# Altium project Rocket logger.PrjPcb
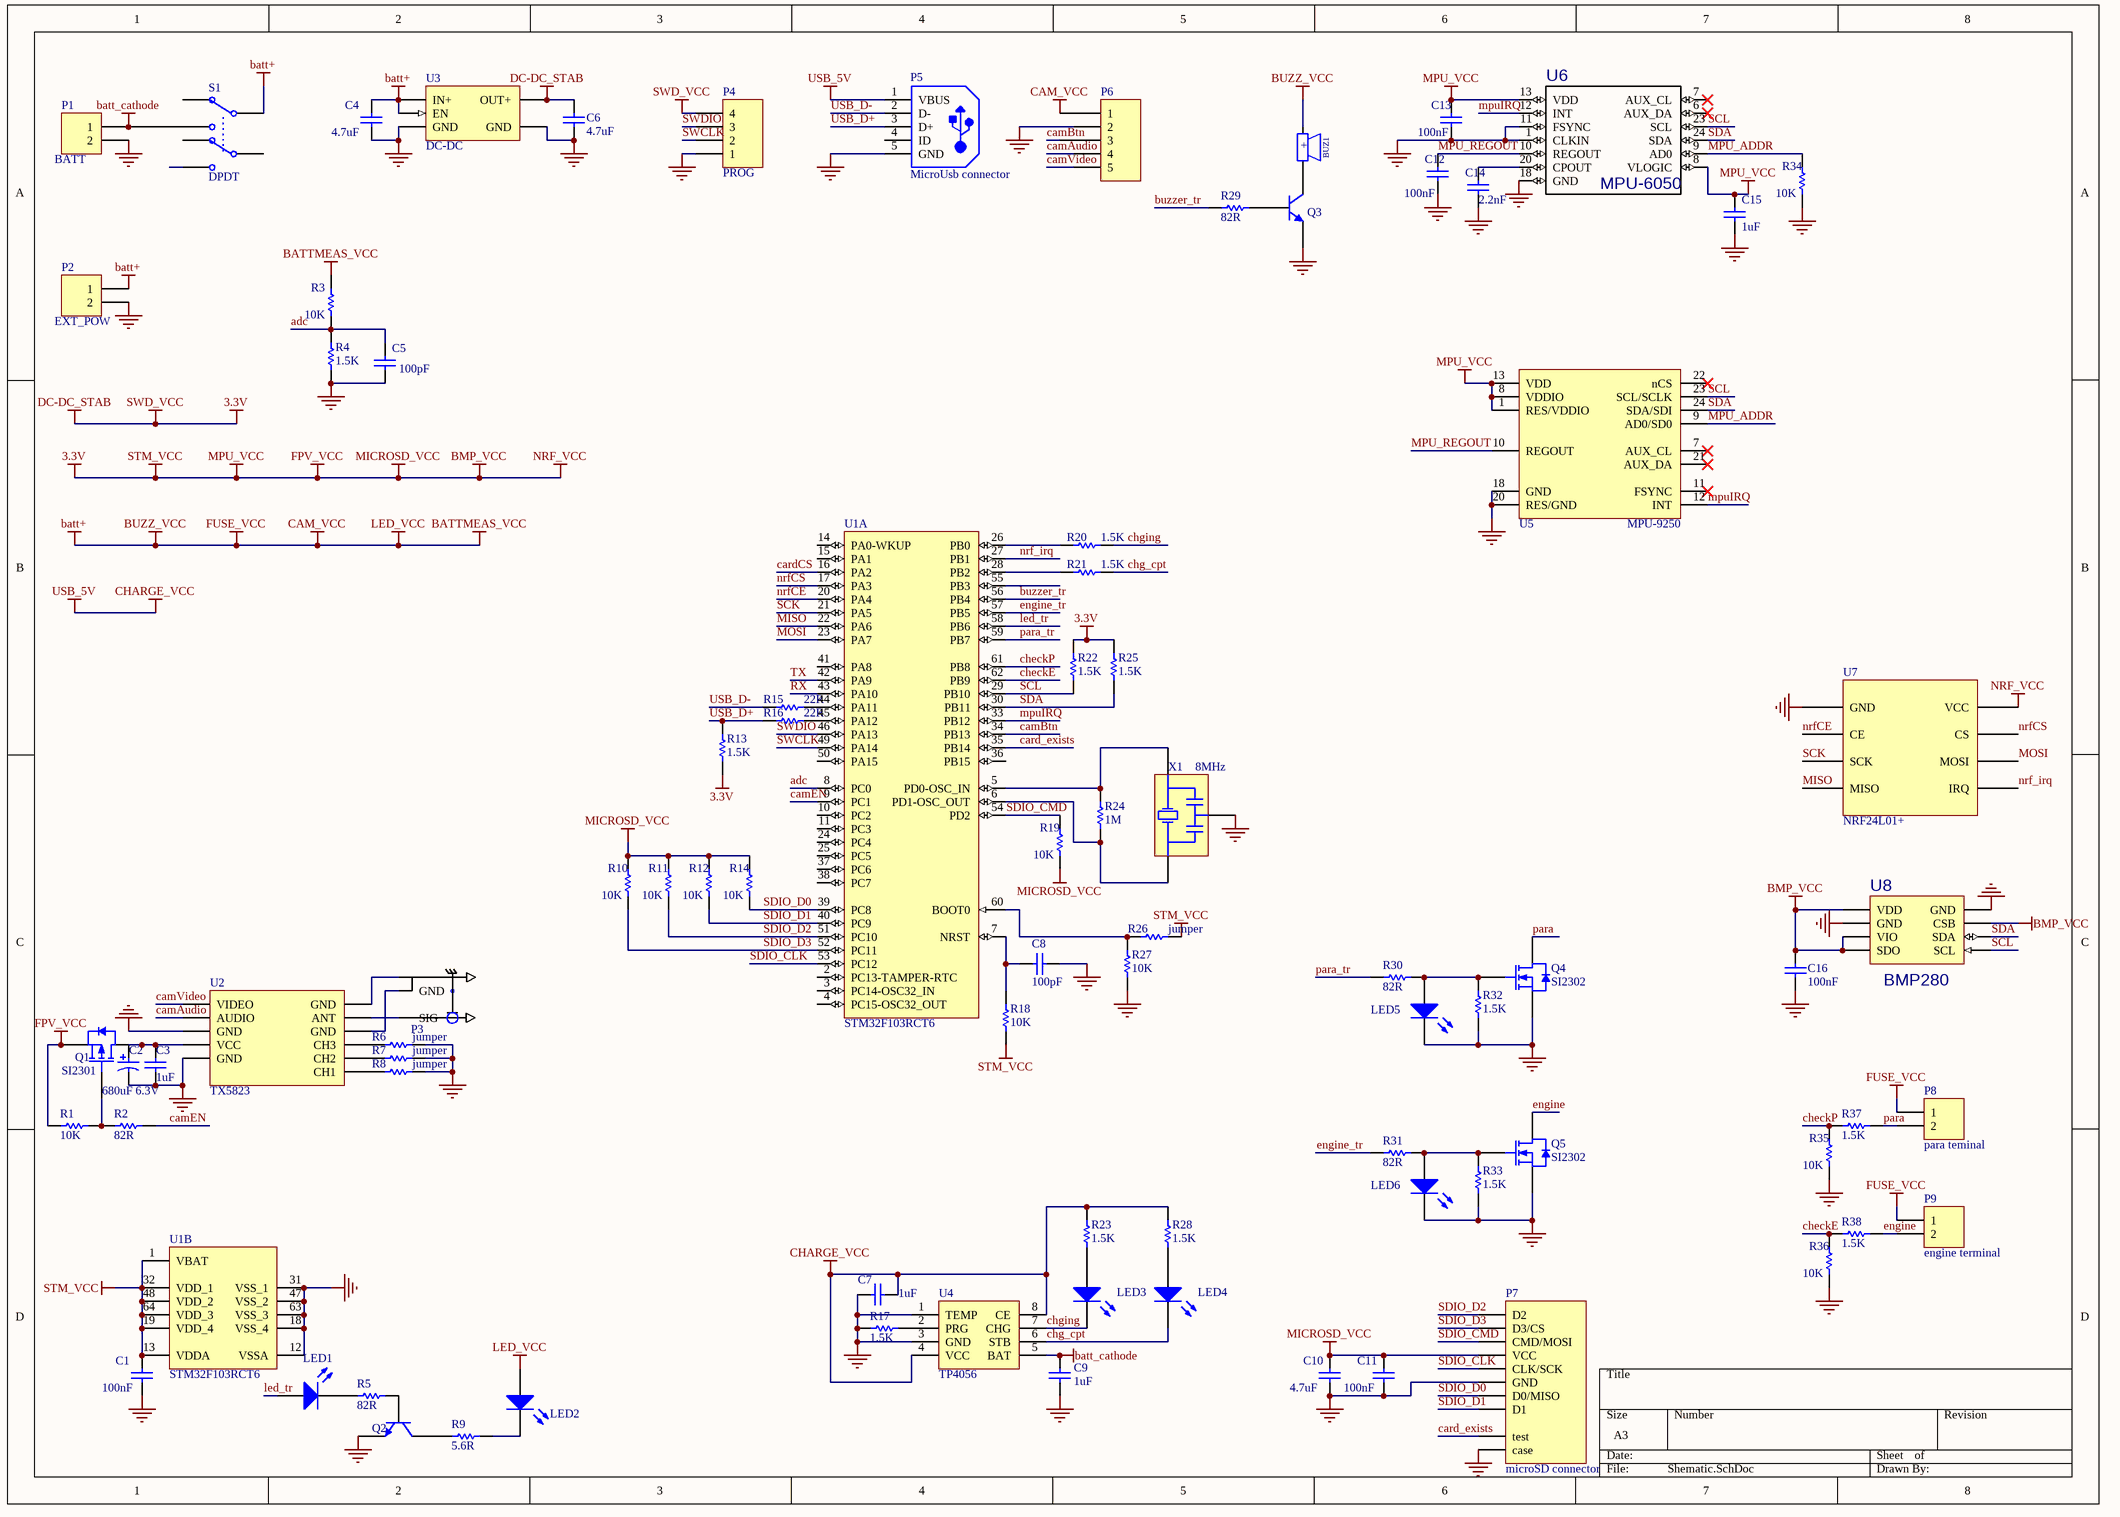
[diagram p0: Shematic.SchDoc]
1 sheet, 86 parts. Net scope: global (net labels, ports and power ports of the same name join across sheets).
Board files: PCB.PcbDoc, panel.PcbDoc

## Sheet Shematic.SchDoc
size A3

### Parts
(Parts that share a designator on the sheet are numbered #1, #2 ... from top to bottom, then left to right.)
BUZ1  Buzzer  [BUZ12X7,6MM]  (value not drawn)
C1  100nF  [CAPC0603(1608)100_L]
C2  680uF 6.3V  [CAPPR55-250-1120X630X1220]
C3  1uF  [CAPC0603(1608)100_L]
C4  4.7uF  [CAPC0603(1608)100_L]
C5  100pF  [CAPC0603(1608)100_L]
C6  4.7uF  [CAPC0603(1608)100_L]
C7  1uF  [CAPC0603(1608)100_L]
C8  100pF  [CAPC0603(1608)100_L]
C9  1uF  [CAPC0603(1608)100_L]
C10  4.7uF  [CAPC0603(1608)100_L]
C11  100nF  [CAPC0603(1608)100_L]
C12  100nF  [CAPC0603(1608)100_L]
C13  100nF  [CAPC0603(1608)100_L]
C14  2.2nF  [CAPC0603(1608)100_L]
C15  1uF  [CAPC0603(1608)100_L]
C16  100nF  [CAPC0603(1608)100_L]
LED1  0805 LED  [0805 LED]  (value not drawn)
LED2  3W LED  [3W LED red]  (value not drawn)
LED3  0805 LED  [0805 LED]  (value not drawn)
LED4  0805 LED  [0805 LED]  (value not drawn)
LED5  0805 LED  [0805 LED]  (value not drawn)
LED6  0805 LED  [0805 LED]  (value not drawn)
P1  BATT  [XH2.54-2]
P2  EXT_POW  [XH2.54-2]
P3  IPX  [IPX]  (value not drawn)
P4  PROG  [PLS-4]
P5  MicroUsb connector  [MicroUsb connector]
P6  XH2.54-5  [XH2.54-5]  (value not drawn)
P7  microSD connector  [Micro SD holder + card]
P8  para teminal  [screw-con-2]
P9  engine terminal  [screw-con-2]
Q1  SI2301  [SOT23-3 L]
Q2  MMBT2222A  [INF-SOT23_L]  (value not drawn)
Q3  MMBT2222A  [INF-SOT23_L]  (value not drawn)
Q4  SI2302  [SOT23-3 L]
Q5  SI2302  [SOT23-3 L]
R1  10K  [RES 0603 (1608) L]
R2  82R  [RES 0603 (1608) L]
R3  10K  [RES 0603 (1608) L]
R4  1.5K  [RES 0603 (1608) L]
R5  82R  [RES 0603 (1608) L]
R6  jumper  [RES 0603 (1608) L]
R7  jumper  [RES 0603 (1608) L]
R8  jumper  [RES 0603 (1608) L]
R9  5.6R  [RES 1206 (3216) N]
R10  10K  [RES 0603 (1608) L]
R11  10K  [RES 0603 (1608) L]
R12  10K  [RES 0603 (1608) L]
R13  1.5K  [RES 0603 (1608) L]
R14  10K  [RES 0603 (1608) L]
R15  22R  [RES 0603 (1608) L]
R16  22R  [RES 0603 (1608) L]
R17  1.5K  [RES 0603 (1608) L]
R18  10K  [RES 0603 (1608) L]
R19  10K  [RES 0603 (1608) L]
R20  1.5K  [RES 0603 (1608) L]
R21  1.5K  [RES 0603 (1608) L]
R22  1.5K  [RES 0603 (1608) L]
R23  1.5K  [RES 0603 (1608) L]
R24  1M  [RES 0603 (1608) L]
R25  1.5K  [RES 0603 (1608) L]
R26  jumper  [RES 0603 (1608) L]
R27  10K  [RES 0603 (1608) L]
R28  1.5K  [RES 0603 (1608) L]
R29  82R  [RES 0603 (1608) L]
R30  82R  [RES 0603 (1608) L]
R31  82R  [RES 0603 (1608) L]
R32  1.5K  [RES 0603 (1608) L]
R33  1.5K  [RES 0603 (1608) L]
R34  10K  [RES 0603 (1608) L]
R35  10K  [RES 0603 (1608) L]
R36  10K  [RES 0603 (1608) L]
R37  1.5K  [RES 0603 (1608) L]
R38  1.5K  [RES 0603 (1608) L]
S1  DPDT  [DPDT  5.8mm SMD]
U1#1  STM32F103RCT6  [STM-LQFP64_N]  (part A of 2)
U1#2  STM32F103RCT6  [STM-LQFP64_N]  (part B of 2)
U2  TX5823  [TX5823]
U3  DC-DC  [DC-DC step up down S9]
U4  TP4056  [SOP-8 N pad]
U5  MPU-9250  [QFN40P300X300X105_HS-25L]
U6  MPU-6050  [QFN-24-4MM2]
U7  NRF24L01+  [NRF24l01 ant]
U8  BMP280  [LGA-8 BMP280]
X1  8MHz  [MURA-CSTCE_G_A-3_V]

### Nets
3.3V: C1.2 C6.2 C10.2 C11.2 C13.1 C15.2 C16.2 P4.4 P7.4(VCC) Q1.3(S) R1.2 R10.1 R11.1 R12.1 R13.2 R14.1 R18.1 R19.2 R22.1 R25.1 R26.2 U1#2.1(VBAT) U1#2.13(VDDA) U1#2.19(VDD_4) U1#2.32(VDD_1) U1#2.48(VDD_2) U1#2.64(VDD_3) U3.2(OUT+) U5.1(RES/VDDIO) U5.8(VDDIO) U5.13(VDD) U6.8(VLOGIC) U6.13(VDD) U7.2(VCC) U8.2(CSB) U8.5(SDO) U8.6(VIO) U8.8(VDD)  [also labelled BMP_VCC, DC-DC_STAB, FPV_VCC, MICROSD_VCC, MPU_VCC, NRF_VCC, STM_VCC, SWD_VCC]
batt+: BUZ1.2 C4.2 LED2.A P2.1 P6.1 P8.1 P9.1 R3.1 S1.2 U3.4(IN+) U3.5(EN)  [also labelled BATTMEAS_VCC, BUZZ_VCC, CAM_VCC, FUSE_VCC, LED_VCC]
batt_cathode: C9.2 P1.1 S1.3 U4.5(BAT)
CHARGE_VCC: C7.1 P5.1(VBUS) R23.1 R28.1 U4.4(VCC) U4.8(CE)  [also labelled USB_5V]
GND: C1.1 C2.2 C3.2 C4.1 C5.1 C6.1 C7.2 C8.1 C9.1 C10.1 C11.1 C12.1 C13.2 C14.1 C15.1 C16.1 LED5.2(K) LED6.2(K) P1.2 P2.2 P4.1 P5.5(GND) P5.6(SHLD1) P5.7(SHLD2) P5.8(SHLD3) P5.9(SHLD4) P5.10(SHLD5) P5.11(SHLD6) P6.2 P7.0(case) P7.6(GND) Q2.2(E) Q3.2(E) Q4.2(S) Q5.2(S) R4.2 R6.2 R7.2 R8.2 R17.1 R27.1 R32.2 R33.2 R34.2 R35.2 R36.2 U1#2.12(VSSA) U1#2.18(VSS_4) U1#2.31(VSS_1) U1#2.47(VSS_2) U1#2.63(VSS_3) U2.3(GND) U2.5(GND) U3.1(GND) U3.3(GND) U4.1(TEMP) U4.3(GND) U4.PAD U5.18(GND) U5.20(RES/GND) U6.1(CLKIN) U6.11(FSYNC) U6.18(GND) U7.1(GND) U8.1(GND) U8.7(GND) X1.2(GND)
adc: C5.2 R3.2 R4.1 U1#1.8(PC0)
buzzer_tr: R29.2 U1#1.56(PB4)
camAudio: P6.4 U2.2(AUDIO)
camBtn: P6.3 U1#1.34(PB13)
camEN: R2.1 U1#1.9(PC1)
camVideo: P6.5 U2.1(VIDEO)
card_exists: P7.9(test) U1#1.35(PB14)
cardCS: U1#1.16(PA2)
checkE: R36.1 R38.1 U1#1.62(PB9)
checkP: R35.1 R37.1 U1#1.61(PB8)
chg_cpt: LED4.2(K) R21.1 U4.6(STB)
chging: LED3.2(K) R20.1 U4.7(CHG)
engine: P9.2 Q5.3(D) R38.2
engine_tr: R31.2 U1#1.57(PB5)
led_tr: LED1.1(A) U1#1.58(PB6)
MISO: U1#1.22(PA6) U7.7(MISO)
MOSI: U1#1.23(PA7) U7.6(MOSI)
MPU_ADDR: R34.1 U5.9(AD0/SD0) U6.9(AD0)
MPU_REGOUT: C12.2 U5.10(REGOUT) U6.10(REGOUT)
mpuIRQ: U1#1.33(PB12) U5.12(INT) U6.12(INT)
nrf_irq: U1#1.27(PB1) U7.8(IRQ)
nrfCE: U1#1.20(PA4) U7.3(CE)
nrfCS: U1#1.17(PA3) U7.4(CS)
para: P8.2 Q4.3(D) R37.2
para_tr: R30.2 U1#1.59(PB7)
RX: U1#1.43(PA10)
SCK: U1#1.21(PA5) U7.5(SCK)
SCL: R22.2 U1#1.29(PB10) U5.23(SCL/SCLK) U6.23(SCL) U8.4(SCL)
SDA: R25.2 U1#1.30(PB11) U5.24(SDA/SDI) U6.24(SDA) U8.3(SDA)
SDIO_CLK: P7.5(CLK/SCK) U1#1.53(PC12)
SDIO_CMD: P7.3(CMD/MOSI) R19.1 U1#1.54(PD2)
SDIO_D0: P7.7(D0/MISO) R14.2 U1#1.39(PC8)
SDIO_D1: P7.8(D1) R12.2 U1#1.40(PC9)
SDIO_D2: P7.1(D2) R11.2 U1#1.51(PC10)
SDIO_D3: P7.2(D3/CS) R10.2 U1#1.52(PC11)
SWCLK: P4.2 U1#1.49(PA14)
SWDIO: P4.3 U1#1.46(PA13)
TX: U1#1.42(PA9)
USB_D+: P5.3(D+) R13.1 R16.1
USB_D-: P5.2(D-) R15.1
NetBUZ1_1: BUZ1.1 Q3.3(C)
NetC2_1: C2.1 C3.1 Q1.2(D) U2.4(VCC)
NetC8_2: C8.2 R18.2 U1#1.7(NRST)
NetC14_2: C14.2 U6.20(CPOUT)
NetLED1_2: LED1.2(K) R5.2
NetLED2_K: LED2.K R9.2
NetLED3_1: LED3.1(A) R23.2
NetLED4_1: LED4.1(A) R28.2
NetLED5_1: LED5.1(A) Q4.1(G) R30.1 R32.1
NetLED6_1: LED6.1(A) Q5.1(G) R31.1 R33.1
NetP3_1: P3.1(GND) U2.9(GND)
NetP3_2: P3.2(GND) U2.11(GND)
NetP3_3: P3.3(SIG) U2.10(ANT)
NetQ1_1: Q1.1(G) R1.1 R2.2
NetQ2_1: Q2.1(B) R5.1
NetQ2_3: Q2.3(C) R9.1
NetQ3_1: Q3.1(B) R29.1
NetR6_1: R6.1 U2.8(CH3)
NetR7_1: R7.1 U2.7(CH2)
NetR8_1: R8.1 U2.6(CH1)
NetR15_2: R15.2 U1#1.44(PA11)
NetR16_2: R16.2 U1#1.45(PA12)
NetR17_2: R17.2 U4.2(PRG)
NetR20_2: R20.2 U1#1.26(PB0)
NetR21_2: R21.2 U1#1.28(PB2)
NetR24_1: R24.1 U1#1.6(PD1-OSC_OUT) X1.1(X1)
NetR24_2: R24.2 U1#1.5(PD0-OSC_IN) X1.3(X2)
NetR26_1: R26.1 R27.2 U1#1.60(BOOT0)

Not connected (* = marked no-connect by the designer): P5 4(ID); S1 1 4 5 6; U1#1 2(PC13-TAMPER-RTC) 3(PC14-OSC32_IN) 4(PC15-OSC32_OUT) 10(PC2) 11(PC3) 14(PA0-WKUP) 15(PA1) 24(PC4) 25(PC5) 36(PB15) 37(PC6) 38(PC7) 41(PA8) 50(PA15) 55(PB3); U5 7(AUX_CL)* 11(FSYNC)* 21(AUX_DA)* 22(nCS)*; U6 6(AUX_DA)* 7(AUX_CL)*

### Notes on the sheet
- (in symbol Buzzer) +

### Library data of the parts
BUZ1 = Buzzer: Active buzzer 5v
C1 C3 C5 C7-C9 C11-C13 C16 = CMP-1035-02585-1: CAP 100nF 16V ±20% 0603 (1608 Metric) Thickness 1mm SMD; Case-EIA: 0603; Tolerance: Â±20%; Case-Metric: 1608; Technology: SMT; Rated Voltage: 16 V; Max Thickness: 1 mm
  C1 C5 C8 C11-C13 C16: Value: 100nF
  C3 C7 C9: Value: 1uF
C2 = CMP-1665-00015-4: Aluminum Electrolytic Capacitor (Radial Lead Type), 100 uF, 35 V, -40 to 85 degC, 2-Pin THD, RoHS, Bulk; Manufacturer: Panasonic; Voltage Rating: 35 V; PackageReference: Radial; ComponentLink2URL: http://industrial.panasonic.com/cdbs/www-data/pdf/RDF0000/ABA0000C1047.pdf; DatasheetVersion: 03/2016; REACH SVHC: No SVHC; Mounting Technology: Through Hole; ComponentLink2Description: Datasheet; Packaging: Bulk; Lead Pitch: 2.5 mm; Height: 11.2 mm; Pins: 2; RoHSCompliant: true; Mount: Through Hole; Package Quantity: 200; Min Operating Temperature: -40 degC; Max Operating Temperature: 85 degC; PackageDescription: 2-Pin Through Hole Device, Dia 6.3 mm, Body Length 11.2 mm; ComponentLink1Description: Manufacturer URL; Length: 11.2 mm; ComponentLink1URL: http://www.panasonic.com/
C4 C6 C10 = CMP-1035-02789-1: CAP 4.7uF 16V ±20% 0603 (1608 Metric) Thickness 1mm SMD; Case-EIA: 0603; Tolerance: Â±20%; Case-Metric: 1608; Max Thickness: 1 mm; Rated Voltage: 16 V; Technology: SMT; Value: 4.7uF
C14 = CMP-1035-02030-1: CAP 2.2nF 16V ±20% 0603 (1608 Metric) Thickness 1mm SMD; Case-Metric: 1608; Case-EIA: 0603; Tolerance: Â±20%; Value: 2.2nF; Technology: SMT; Rated Voltage: 16 V; Max Thickness: 1 mm
C15 = CMP-1035-02312-1: CAP 10nF 16V ±20% 0603 (1608 Metric) Thickness 1mm SMD; Case-EIA: 0603; Tolerance: Â±20%; Case-Metric: 1608; Max Thickness: 1 mm; Value: 1uF; Technology: SMT; Rated Voltage: 16 V
LED1 LED3-LED6 = 0805 LED: 0805; Published: 8-Jun-2000; LatestRevisionDate: 08-Jul-2005; LatestRevisionNote: Mech Layer 1 removed.; PackageReference: LED-0; Publisher: Altium Limited; PackageDescription: LED; 2 Leads
LED2 = 3W LED: 3W or 1W led without PCB star
P1 P2 = XH2.54-2
P4 = PLS-4: Single row pins
P7 = microSD: microSD holder; LatestRevisionDate: 17-Jul-2002; LatestRevisionNote: Re-released for DXP Platform.; Publisher: Altium Limited
P8 P9 = screw-con-2: screw con 2-pin, 5.08mm pitch; LatestRevisionDate: 17-Jul-2002; LatestRevisionNote: Re-released for DXP Platform.; Publisher: Altium Limited
Q1 = SI2301: P-ch MOSFET 2.8A 20V
Q2 Q3 = CMP-1178-00009-1: NPN Silicon Switching Transistor, 40 V VCEO, 600 mA IC, SOT23, Reel, Green; Manufacturer: Infineon; VCBO (max): 75 V; IC: 150 mA; ICBO (max): 10 nA; VCE (max): 10 V; VCEO (max): 40 V; VEBO (max): 6 V; IC (max): 600 mA; Green: TRUE; ComponentLink1URL: http://www.infineon.com/; ComponentLink2Description: Datasheet; Mounting Technology: Surface Mount; ComponentLink3URL: http://www.infineon.com/dgdl/SOT23-Package_Overview.pdf?folderId=db3a30431936bc4b0119532290053c66&fileId=db3a30431936bc4b0119533468123c85; PackageDescription: 3-Pin Small Outline Transistor Package, 1.3 x 2.9 mm Body, 0.95 mm Pitch; Packing: Reel; PackageVersion: Apr-08; PartNumber: MMBT2222A; Polarity: NPN; ComponentLink2URL: http://www.infineon.com/dgdl/smbt2222a_mmbt2222a.pdf?folderId=db3a30431441fb5d011445fab851018e&fileId=db3a30431441fb5d011445fbaff0018f; PackageReference: SOT23; VCE: 10 V; ComponentLink1Description: Manufacturer URL; ComponentLink3Description: Package Specification
Q4 Q5 = SI2302: N-ch MOSFET 3A 20V
R1-R8 R10-R38 = Res 0603: Case-EIA: 0603; Case-Metric: 1608; Power: 0.1W; Technology: SMT
  R1 R3 R10-R12 R14 R18 R19 R27 R34-R36: Value: 10K
  R2 R5 R29-R31: Value: 82R
  R4 R13 R17 R20-R23 R25 R28 R32 R33 R37 R38: Value: 1.5K
  R6-R8 R26: Value: jumper
  R15 R16: Value: 22R
  R24: Value: 1M
R9 = Res 1206: Case-EIA: 1206; Case-Metric: 3216; Power: 0.25W; Technology: SMT; Value: 5.6R
S1 = Double switch: Different footprints; Published: 24-Mar-1999; LatestRevisionDate: 17-Jul-2002; LatestRevisionNote: Re-released for DXP Platform.; PackageReference: DPDT-6; Publisher: Altium Limited; PackageDescription: Switch; 6 Leads
U1#1 U1#2 = CMP-0237-00009-4: ARM Cortex-M3 32-bit MCU, 256 KB Flash, 48 KB Internal RAM, 51 I/Os, 64-pin LQFP, -40 to 85 degC, Tray; I/Os (High Current): 51; Supply Voltage(Vcc) min (V): 2; Operating Frequency(F) (Processor speed) (MHz): 72; D/A Converter: 2x12-bit (2 Channel); Internal RAM Size (kB): 48; FLASH Size (Prog) (kB): 256; A/D Converter: 3x12-bit (16 Channel); Mounting Technology: Surface Mount; ComponentLink2URL: http://www.st.com/st-web-ui/static/active/en/resource/technical/document/datasheet/CD00191185.pdf; ComponentLink1Description: Manufacturer URL; ComponentLink1URL: http://www.st.com/web/en/home.html; Packing: Tray; ComponentLink3URL: http://www.st.com/st-web-ui/static/active/en/resource/technical/document/datasheet/DM00037051.pdf; ComponentLink2Description: Datasheet; Core: ARM Cortex-M3; DatasheetVersion: Rev. 8; PackageReference: LQFP64; ComponentLink3Description: Package Specification; PackageVersion: Rev. 4, 06/2013; PackageDescription: 64-Pin Low Profile Quad Flat Package, 10 x 10 mm Body, 0.5 mm Pitch; PartNumber: STM32F103RCT6
U2 = TX5823: FPV video transmitter 200mW
U3 = DC-DC step up down S9
U4 = TP4056: Li battery charger IC
U7 = NRF24L01+: Wirless module 2.4GHz
X1 = CMP-2100-03620-1: Ceramic Resonator, 8 MHz, +/- 0.5%, -20 to 80 degC, 3-Pin SMD, RoHS, Tape and Reel; Manufacturer: Murata; Capacitance: 33pF; Frequency Stability: 0.2%; Datasheet Version: 42339.0; RoHSCompliant: True; Datasheet URL: http://www.murata.com/~/media/webrenewal/support/library/catalog/products/timingdevice/ceralock/p16e.ashx; Case/Package: Ceramic; Load Capacitance: 33pF; Tolerance: 0.5%; Self Resonant Frequency: 8MHz; Mount: SurfaceMount; Height: 0.031inch; Number of Pins: 3; Package Description: 3-Pin Surface Mount Device, Body 3.2 x 1.3 mm, Pitch 1.2 mm; Package Quantity: 1; Lead Free: LeadFree; Contact Plating: Gold; REACH SVHC: NoSVHC; Length: 0.126inch; Width: 0.051inch; Manufacturer URL: http://www.murata.com/; Packaging: TapeandReel; Termination: SMD/SMT; Frequency Tolerance: 0.5%; Max Operating Temperature: 80degC; Composition: Ceramic; Package Reference: CSTCE_G_A-3; Min Operating Temperature: -20degC; Frequency: 8MHz
U6 = MPU-6050: Value: *
U8 = BMP280: Value: *